# Altium schematic sheet 7_ZynTra-DDR3L Modules.SchDoc
size 508 x 279 mm; SheetNumber: 7; SheetTotal: 10
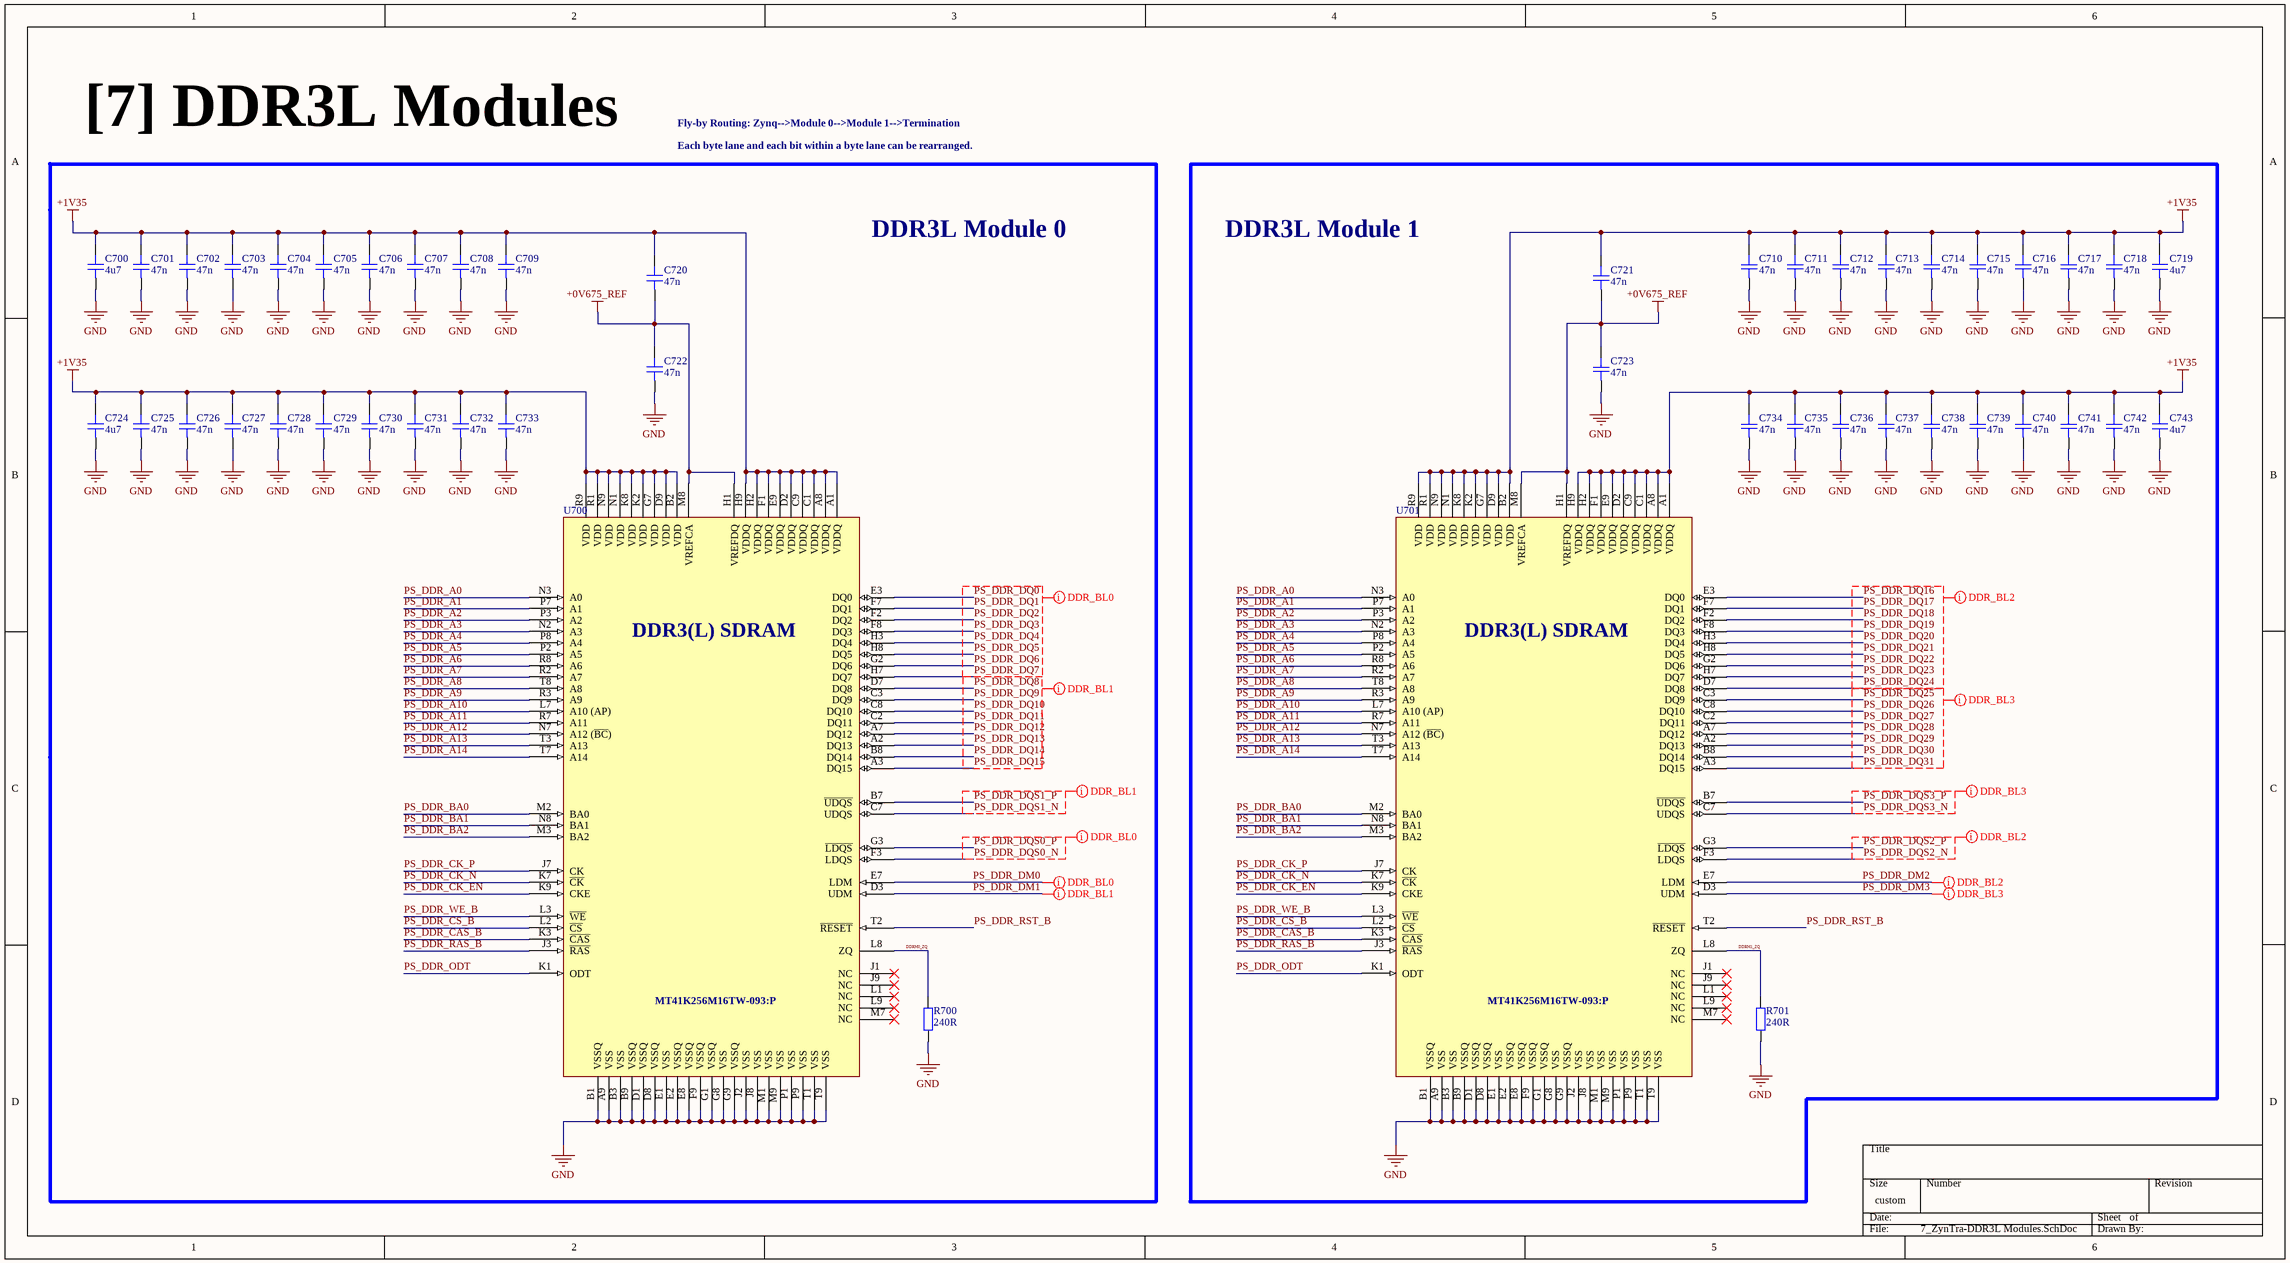
[diagram p0: 7_ZynTra-DDR3L Modules.SchDoc]

## Parts
C700  4u7  [CAP_0402]
C701  47n  [CAP_0201]
C702  47n  [CAP_0201]
C703  47n  [CAP_0201]
C704  47n  [CAP_0201]
C705  47n  [CAP_0201]
C706  47n  [CAP_0201]
C707  47n  [CAP_0201]
C708  47n  [CAP_0201]
C709  47n  [CAP_0201]
C710  47n  [CAP_0201]
C711  47n  [CAP_0201]
C712  47n  [CAP_0201]
C713  47n  [CAP_0201]
C714  47n  [CAP_0201]
C715  47n  [CAP_0201]
C716  47n  [CAP_0201]
C717  47n  [CAP_0201]
C718  47n  [CAP_0201]
C719  4u7  [CAP_0402]
C720  47n  [CAP_0201]
C721  47n  [CAP_0201]
C722  47n  [CAP_0201]
C723  47n  [CAP_0201]
C724  4u7  [CAP_0402]
C725  47n  [CAP_0201]
C726  47n  [CAP_0201]
C727  47n  [CAP_0201]
C728  47n  [CAP_0201]
C729  47n  [CAP_0201]
C730  47n  [CAP_0201]
C731  47n  [CAP_0201]
C732  47n  [CAP_0201]
C733  47n  [CAP_0201]
C734  47n  [CAP_0201]
C735  47n  [CAP_0201]
C736  47n  [CAP_0201]
C737  47n  [CAP_0201]
C738  47n  [CAP_0201]
C739  47n  [CAP_0201]
C740  47n  [CAP_0201]
C741  47n  [CAP_0201]
C742  47n  [CAP_0201]
C743  4u7  [CAP_0402]
R700  240R  [RES_0201]
R701  240R  [RES_0201]
U700  MT41K256M16TW-093:P  [96-BALL, FBGA, 0.8mm]
U701  MT41K256M16TW-093:P  [96-BALL, FBGA, 0.8mm]

## Blocks framed on the sheet
DDR3L Module 0: C700-C709 C720 C722 C724-C733 R700 U700
DDR3L Module 1: C710-C719 C721 C723 C734-C743 R701 U701

## Nets
+0V675_REF: C720.1 C721.1 C722.2 C723.2 U700.H1(VREFDQ) U700.M8(VREFCA) U701.H1(VREFDQ) U701.M8(VREFCA)
+1V35: C700.2 C701.2 C702.2 C703.2 C704.2 C705.2 C706.2 C707.2 C708.2 C709.2 C710.2 C711.2 C712.2 C713.2 C714.2 C715.2 C716.2 C717.2 C718.2 C719.2 C720.2 C721.2 C724.2 C725.2 C726.2 C727.2 C728.2 C729.2 C730.2 C731.2 C732.2 C733.2 C734.2 C735.2 C736.2 C737.2 C738.2 C739.2 C740.2 C741.2 C742.2 C743.2 U700.A1(VDDQ) U700.A8(VDDQ) U700.B2(VDD) U700.C1(VDDQ) U700.C9(VDDQ) U700.D2(VDDQ) U700.D9(VDD) U700.E9(VDDQ) U700.F1(VDDQ) U700.G7(VDD) U700.H2(VDDQ) U700.H9(VDDQ) U700.K2(VDD) U700.K8(VDD) U700.N1(VDD) U700.N9(VDD) U700.R1(VDD) U700.R9(VDD) U701.A1(VDDQ) U701.A8(VDDQ) U701.B2(VDD) U701.C1(VDDQ) U701.C9(VDDQ) U701.D2(VDDQ) U701.D9(VDD) U701.E9(VDDQ) U701.F1(VDDQ) U701.G7(VDD) U701.H2(VDDQ) U701.H9(VDDQ) U701.K2(VDD) U701.K8(VDD) U701.N1(VDD) U701.N9(VDD) U701.R1(VDD) U701.R9(VDD)
GND: C700.1 C701.1 C702.1 C703.1 C704.1 C705.1 C706.1 C707.1 C708.1 C709.1 C710.1 C711.1 C712.1 C713.1 C714.1 C715.1 C716.1 C717.1 C718.1 C719.1 C722.1 C723.1 C724.1 C725.1 C726.1 C727.1 C728.1 C729.1 C730.1 C731.1 C732.1 C733.1 C734.1 C735.1 C736.1 C737.1 C738.1 C739.1 C740.1 C741.1 C742.1 C743.1 R700.1 R701.1 U700.A9(VSS) U700.B1(VSSQ) U700.B3(VSS) U700.B9(VSSQ) U700.D1(VSSQ) U700.D8(VSSQ) U700.E1(VSS) U700.E2(VSSQ) U700.E8(VSSQ) U700.F9(VSSQ) U700.G1(VSSQ) U700.G8(VSS) U700.G9(VSSQ) U700.J2(VSS) U700.J8(VSS) U700.M1(VSS) U700.M9(VSS) U700.P1(VSS) U700.P9(VSS) U700.T1(VSS) U700.T9(VSS) U701.A9(VSS) U701.B1(VSSQ) U701.B3(VSS) U701.B9(VSSQ) U701.D1(VSSQ) U701.D8(VSSQ) U701.E1(VSS) U701.E2(VSSQ) U701.E8(VSSQ) U701.F9(VSSQ) U701.G1(VSSQ) U701.G8(VSS) U701.G9(VSSQ) U701.J2(VSS) U701.J8(VSS) U701.M1(VSS) U701.M9(VSS) U701.P1(VSS) U701.P9(VSS) U701.T1(VSS) U701.T9(VSS)
DDRM0_ZQ: R700.2 U700.L8(ZQ)
DDRM1_ZQ: R701.2 U701.L8(ZQ)
PS_DDR_A0: U700.N3(A0) U701.N3(A0)
PS_DDR_A1: U700.P7(A1) U701.P7(A1)
PS_DDR_A2: U700.P3(A2) U701.P3(A2)
PS_DDR_A3: U700.N2(A3) U701.N2(A3)
PS_DDR_A4: U700.P8(A4) U701.P8(A4)
PS_DDR_A5: U700.P2(A5) U701.P2(A5)
PS_DDR_A6: U700.R8(A6) U701.R8(A6)
PS_DDR_A7: U700.R2(A7) U701.R2(A7)
PS_DDR_A8: U700.T8(A8) U701.T8(A8)
PS_DDR_A9: U700.R3(A9) U701.R3(A9)
PS_DDR_A10: U700.L7(A10_(AP)) U701.L7(A10_(AP))
PS_DDR_A11: U700.R7(A11) U701.R7(A11)
PS_DDR_A12: U700.N7(A12_(~{BC})) U701.N7(A12_(~{BC}))
PS_DDR_A13: U700.T3(A13) U701.T3(A13)
PS_DDR_A14: U700.T7(A14) U701.T7(A14)
PS_DDR_BA0: U700.M2(BA0) U701.M2(BA0)
PS_DDR_BA1: U700.N8(BA1) U701.N8(BA1)
PS_DDR_BA2: U700.M3(BA2) U701.M3(BA2)
PS_DDR_CAS_B: U700.K3(~{CAS}) U701.K3(~{CAS})
PS_DDR_CK_EN: U700.K9(CKE) U701.K9(CKE)
PS_DDR_CK_N: U700.K7(~{CK}) U701.K7(~{CK})
PS_DDR_CK_P: U700.J7(CK) U701.J7(CK)
PS_DDR_CS_B: U700.L2(~{CS}) U701.L2(~{CS})
PS_DDR_DM0: U700.E7(LDM)
PS_DDR_DM1: U700.D3(UDM)
PS_DDR_DM2: U701.E7(LDM)
PS_DDR_DM3: U701.D3(UDM)
PS_DDR_DQ0: U700.E3(DQ0)
PS_DDR_DQ1: U700.F7(DQ1)
PS_DDR_DQ2: U700.F2(DQ2)
PS_DDR_DQ3: U700.F8(DQ3)
PS_DDR_DQ4: U700.H3(DQ4)
PS_DDR_DQ5: U700.H8(DQ5)
PS_DDR_DQ6: U700.G2(DQ6)
PS_DDR_DQ7: U700.H7(DQ7)
PS_DDR_DQ8: U700.D7(DQ8)
PS_DDR_DQ9: U700.C3(DQ9)
PS_DDR_DQ10: U700.C8(DQ10)
PS_DDR_DQ11: U700.C2(DQ11)
PS_DDR_DQ12: U700.A7(DQ12)
PS_DDR_DQ13: U700.A2(DQ13)
PS_DDR_DQ14: U700.B8(DQ14)
PS_DDR_DQ15: U700.A3(DQ15)
PS_DDR_DQ16: U701.E3(DQ0)
PS_DDR_DQ17: U701.F7(DQ1)
PS_DDR_DQ18: U701.F2(DQ2)
PS_DDR_DQ19: U701.F8(DQ3)
PS_DDR_DQ20: U701.H3(DQ4)
PS_DDR_DQ21: U701.H8(DQ5)
PS_DDR_DQ22: U701.G2(DQ6)
PS_DDR_DQ23: U701.H7(DQ7)
PS_DDR_DQ24: U701.D7(DQ8)
PS_DDR_DQ25: U701.C3(DQ9)
PS_DDR_DQ26: U701.C8(DQ10)
PS_DDR_DQ27: U701.C2(DQ11)
PS_DDR_DQ28: U701.A7(DQ12)
PS_DDR_DQ29: U701.A2(DQ13)
PS_DDR_DQ30: U701.B8(DQ14)
PS_DDR_DQ31: U701.A3(DQ15)
PS_DDR_DQS0_N: U700.F3(LDQS)
PS_DDR_DQS0_P: U700.G3(~{LDQS})
PS_DDR_DQS1_N: U700.C7(UDQS)
PS_DDR_DQS1_P: U700.B7(~{UDQS})
PS_DDR_DQS2_N: U701.F3(LDQS)
PS_DDR_DQS2_P: U701.G3(~{LDQS})
PS_DDR_DQS3_N: U701.C7(UDQS)
PS_DDR_DQS3_P: U701.B7(~{UDQS})
PS_DDR_ODT: U700.K1(ODT) U701.K1(ODT)
PS_DDR_RAS_B: U700.J3(~{RAS}) U701.J3(~{RAS})
PS_DDR_RST_B: U700.T2(~{RESET}) U701.T2(~{RESET})
PS_DDR_WE_B: U700.L3(~{WE}) U701.L3(~{WE})

Not connected (* = marked no-connect by the designer): U700 J1(NC)* J9(NC)* L1(NC)* L9(NC)* M7(NC)*; U701 J1(NC)* J9(NC)* L1(NC)* L9(NC)* M7(NC)*

## Layout directives
net class DDR_BL0; rule Matched Net Lengths [Delay Tolerance = 10ps]: PS_DDR_DM0, PS_DDR_DQ0, PS_DDR_DQ1, PS_DDR_DQ2, PS_DDR_DQ3, PS_DDR_DQ4, PS_DDR_DQ5, PS_DDR_DQ6, PS_DDR_DQ7, PS_DDR_DQS0_N, PS_DDR_DQS0_P
net class DDR_BL1; rule Matched Net Lengths [Delay Tolerance = 10ps]: PS_DDR_DM1, PS_DDR_DQ7, PS_DDR_DQ8, PS_DDR_DQ9, PS_DDR_DQ10, PS_DDR_DQ11, PS_DDR_DQ12, PS_DDR_DQ13, PS_DDR_DQ14, PS_DDR_DQ15, PS_DDR_DQS1_N, PS_DDR_DQS1_P
net class DDR_BL2; rule Matched Net Lengths [Delay Tolerance = 10ps]: PS_DDR_DM2, PS_DDR_DQ16, PS_DDR_DQ17, PS_DDR_DQ18, PS_DDR_DQ19, PS_DDR_DQ20, PS_DDR_DQ21, PS_DDR_DQ22, PS_DDR_DQ23, PS_DDR_DQ24, PS_DDR_DQS2_N, PS_DDR_DQS2_P
rule Matched Net Lengths [Delay Tolerance = 10ps]; net class DDR_BL3: PS_DDR_DM3, PS_DDR_DQ24, PS_DDR_DQ25, PS_DDR_DQ26, PS_DDR_DQ27, PS_DDR_DQ28, PS_DDR_DQ29, PS_DDR_DQ30, PS_DDR_DQ31, PS_DDR_DQS3_N, PS_DDR_DQS3_P

## Notes on the sheet
- [7] DDR3L Modules
- Fly-by Routing: Zynq-->Module 0-->Module 1-->Termination
- Each byte lane and each bit within a byte lane can be rearranged.
- (in symbol MT41K256M16TW-093:P) DDR3(L) SDRAM

## Library data of the parts
C700 C719 C724 C743 = CAP_0402: Capacitor SMD 0402; Manufacturer: *; Manufacturer Part Number: *; Distributor Link: *; LCSC: *; Rating: *; Dielectric: *
C701-C718 C720-C723 C725-C742 = CAP_0201: Capacitor SMD 0201; Manufacturer: *; Manufacturer Part Number: *; Distributor Link: *; LCSC: *; Rating: *; Dielectric: *
R700 R701 = RES_0201: Resistor SMD 0201; Manufacturer: *; Manufacturer Part Number: *; Distributor Link: *; LCSC: *
U700 U701 = MT41K256M16TW-093:P: DDR3L SDRAM; Manufacturer: Micron Technology; Manufacturer Part Number: MT41K256M16TW-093:P; Supplier Link: https://www.mouser.com.tr/ProductDetail/Micron/MT41K256M16TW-093P?qs=rrS6PyfT74eBsDr2Pdy9oQ%3D%3D